# Altium project UART_Translator.PrjPcb
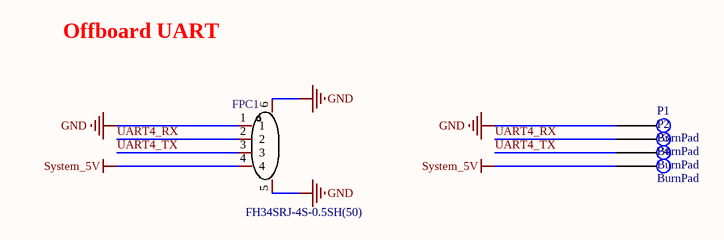
[diagram p0: UART_Translator.SchDoc]
1 sheet, 5 parts. Net scope: global (net labels, ports and power ports of the same name join across sheets).
Board file: UART_Translator.PcbDoc

## Sheet UART_Translator.SchDoc
size A4; SheetNumber: 1; SheetTotal: 1

### Parts
FPC1  FH34SRJ-4S-0.5SH(50)  [FFC-SMD_4P-P0.50_FH34SRJ-4S-0.5SH]
P1  BurnPad  [BurnPad_0.5mm]
P2  BurnPad  [BurnPad_0.5mm]
P3  BurnPad  [BurnPad_0.5mm]
P4  BurnPad  [BurnPad_0.5mm]

### Nets
GND: FPC1.1 FPC1.5 FPC1.6 P1.1
System_5V: FPC1.4 P4.1
UART4_RX: FPC1.2 P2.1
UART4_TX: FPC1.3 P3.1

### Notes on the sheet
- Offboard UART
- Title
- Size:
- Date:
- A4
- Number:
- Time:
- Revision:
- Sheet
- of
- 后厂村路直博生
- File:

### Library data of the parts
FPC1 = FH34SRJ-4S-0.5SH(50): Manufacturer: HRS(广濑); Add into BOM: yes; Number of Contacts: 4P; Pitch: 0.5mm; FFC, FCB Thickness: 0.3mm; Symbol: FH34SRJ-4S-0.5SH(50); Device: FH34SRJ-4S-0.5SH(50); Supplier: LCSC; Supplier Part: C596732; Manufacturer Part: FH34SRJ-4S-0.5SH(50); JLCPCB Part Class: Extended Part; LCSC Part Name: 间距:0.5mm P数:4P 双侧触点/上下接; Supplier Footprint: SMD,P=0.5mm,卧贴; Datasheet: https://atta.szlcsc.com/upload/public/pdf/source/20210303/C596732_A8DFF1AAA7954D31ED084C13292B0B28.pdf; Convert to PCB: yes; Locking Feature: -; Contact Type: 双侧触点/上下接; Mounting Type: 卧贴; Height Above Board: 1mm; Contact Material: 磷青铜; Contact Plating: 金; Operating Temperature Range: -55℃~+105℃; Soldering Temperature(Max): -